# Altium schematic sheet GPS_NEO.SchDoc
size B
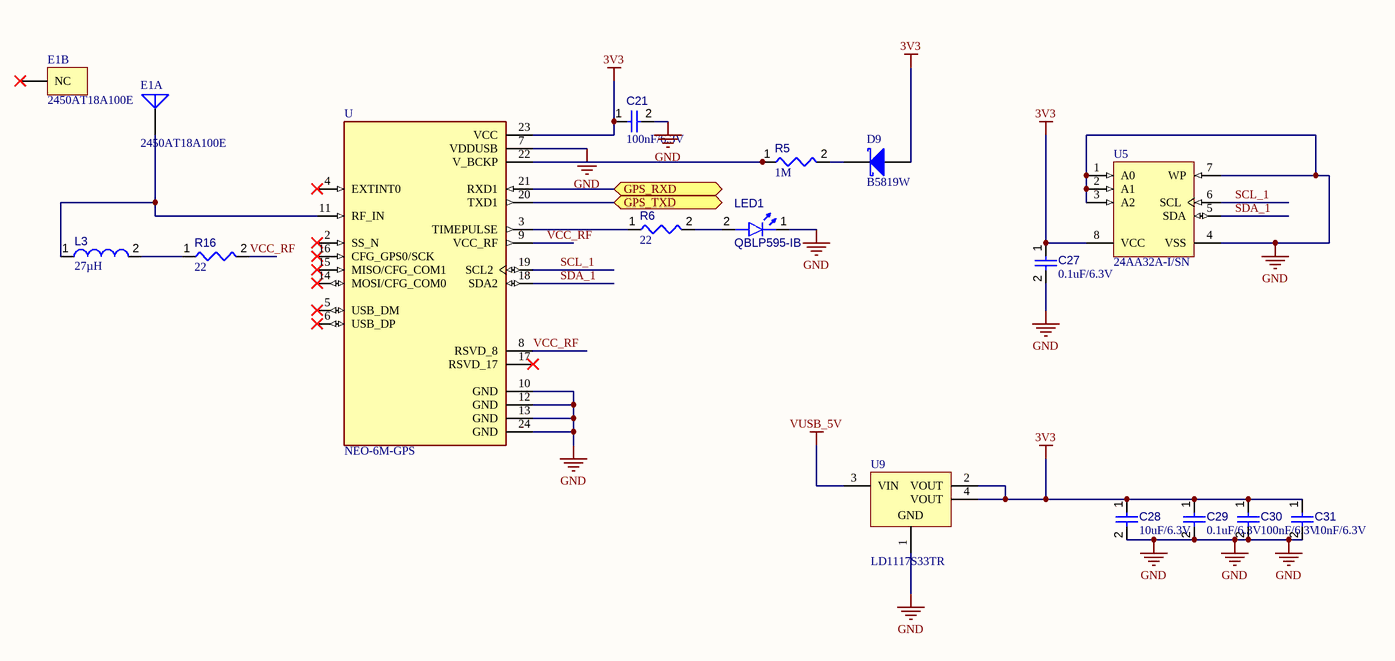
[diagram p0: GPS_NEO.SchDoc]

## Parts
C21  value 100nF/6.3V  [CAPC0402(1005)60_L]  (hidden comment: Capacitor 220nF +/-20% 10V 0402)
C27  value 0.1uF/6.3V  [CAPC0402(1005)60_L]  (hidden comment: Capacitor 220nF +/-20% 10V 0402)
C28  value 10uF/6.3V  [CAPC0402(1005)60_L]  (hidden comment: Capacitor 220nF +/-20% 10V 0402)
C29  value 0.1uF/6.3V  [CAPC0402(1005)60_L]  (hidden comment: Capacitor 220nF +/-20% 10V 0402)
C30  value 100nF/6.3V  [CAPC0402(1005)60_L]  (hidden comment: Capacitor 220nF +/-20% 10V 0402)
C31  value 10nF/6.3V  [CAPC0402(1005)60_L]  (hidden comment: Capacitor 220nF +/-20% 10V 0402)
D9  B5819W  [MCC-SOD123_V]
E1  2450AT18A100E  [JT-2450AT18A100-2_V]  (parts A,B of 2)
L3  value 27µH  [IND1005X55X20VL5T10]  (hidden comment: ELJ-RF2N2DFB)
LED1  QBLP595-IB  [QTB-QBLP595_V]
R5  value 1M  [RESC0402(1005)_L]  (hidden comment: Resistor 1M +/-5 % 0402 63 mW)
R6  value 22  [RESC0402(1005)_L]  (hidden comment: Resistor 22R  +/-5 % 0402 63 mW)
R16  value 22  [RESC0402(1005)_L]  (hidden comment: Resistor 22R  +/-5 % 0402 63 mW)
U  NEO-6M-GPS  [XCVR_NEO-6M-GPS]
U5  24AA32A-I/SN  [SOIC-SN8_N]
U9  LD1117S33TR  [STM-SOT-223_M]

## Ports
GPS_RXD (bidir), GPS_TXD (bidir)

## Nets
3V3: C21.1 C27.1 C28.1 C29.1 C30.1 C31.1 D9.1(A) U.23(VCC) U5.8(VCC) U9.2(VOUT) U9.4(VOUT)
GND: C21.2 C27.2 C28.2 C29.2 C30.2 C31.2 LED1.1(K) U.7(VDDUSB) U.10(GND) U.12(GND) U.13(GND) U.24(GND) U5.1(A0) U5.2(A1) U5.3(A2) U5.4(VSS) U5.7(WP) U9.1(GND)
VUSB_5V: U9.3(VIN)
GPS_RXD: U.21(RXD1) ; port GPS_RXD
GPS_TXD: U.20(TXD1) ; port GPS_TXD
SCL_1: U.19(SCL2) U5.6(SCL)
SDA_1: U.18(SDA2) U5.5(SDA)
VCC_RF: R16.2 U.8(RSVD_8) U.9(VCC_RF)
NetD9_2: D9.2(K) R5.2
NetE1_1: E1.1(FP) L3.1 U.11(RF_IN)
NetL3_2: L3.2 R16.1
NetLED1_2: LED1.2(A) R6.2
NetR5_1: R5.1 U.22(V_BCKP)
NetR6_1: R6.1 U.3(TIMEPULSE)

Not connected (* = marked no-connect by the designer): E1 2(NC)*; U 2(SS_N)* 4(EXTINT0)* 5(USB_DM)* 6(USB_DP)* 14(MOSI/CFG_COM0)* 15(MISO/CFG_COM1)* 16(CFG_GPS0/SCK)* 17(RSVD_17)*

## Library data of the parts
C21 C27-C31 = CMP-001-00057-2: Chip Capacitor, 220nF +/-20%, 10V, 0402, Thickness 0.6 mm; Tolerance: 10%; Case/Package: 0402; Mounting Technology: SMT; Pins: 2; Max Operating Temperature: 85°C; Min Operating Temperature: -55°C; Voltage Rating: 10V
D9 = CMP-004-00005-1: Schottky Barrier Rectifier, 40 V, 1 A, -65 to 125 degC, 2-Pin SOD123, RoHS, Tape and Reel; Manufacturer: Micro Commercial Components; Manufacturer URL: http://www.mccsemi.com/; Package Reference: SOD123; Package URL: http://www.mccsemi.com/up_pdf/1N4448W(SOD-123).pdf; Mounting Technology: SM; Datasheet URL: http://www.mccsemi.com/up_pdf/B5817W-B5819W(SOD-123).pdf; Package Description: 2-Pin Small Outline Diode, Body 2.7 x 1.6 mm, Height 1.35 mm; Case/Package: SOD123; Datasheet Version: Rev. B, 01/2013; RoHS Compliant: Unknown
E1 = CMP-2000-05167-1: Ceramic Antenna, 2.45 GHZ, 2 W, -40 to 125 degC, 2-Pin SMD, RoHS, Tape and Reel; Manufacturer: Johanson Technology; Maximum Frequency: 2500MHz; Typical Antenna Gain: 0.5dB; Minimum Frequency: 2400MHz; Manufacturer URL: https://www.johansontechnology.com/; Type: Ceramic; Datasheet Version: Rev. 1.3, 07/2014; Category: Antenna; Package: 2Case18-4; Datasheet URL: http://www.johansontechnology.com/datasheets/antennas/2450AT18A100.pdf
L3 = CMP-006-00006-4: Chip Inductor, 2.2 nH, +/- 0.3 nH, 400 mA, -40 to 85 degC, 0402 (1005 Metric), RoHS, Tape and Reel; Manufacturer: Panasonic; Current Rating: 400mA; Tolerance: 5%; Shielding: Unshielded; Core Material: Ceramic; Q Factor: 8; Package Reference: 0402; Package Description: 2-Pin Surface Mount Device, Body 1 x 0.5 mm; Packaging: TapeandReel; Max Operating Temperature: 85°C; Case/Package: 0402; Min Operating Temperature: -20°C; Mounting Technology: SM; Package Quantity: 10000; Datasheet Version: Sep-12; RoHS Compliant: True; Datasheet URL: http://www.bourns.com/docs/Product-Datasheets/cm322522.pdf
LED1 = CMP-007-00042-2: Chip LED 0402, Blue, 0.02 A, 3.1 to 3.7 V, -40 to 80 degC, 2-Pin SMD, RoHS, Tape and Reel; Mounting Technology: SMT; Colour: Blue; RoHS Compliant: Yes; Pins: 2; Case/Package: 0402
R5 = CMP-009-00151-2: Chip Resistor, 1 MOhms, +/-5 %, 63 mW, -55 to 155 degC, 0402; Power: 63mW; Tolerance: 5%; Min Operating Temperature: -55°C; Max Operating Temperature: 155°C; Pins: 2; Case/Package: 0402
R6 R16 = CMP-009-00164-2: Chip Resistor, 22 Ohms, +/-5 %, 63 mW, -55 to 155 degC, 0402; Tolerance: 5%; Power: 63mW; Max Operating Temperature: 155°C; Case/Package: 0402; Pins: 2; Min Operating Temperature: -55°C
U = NEO-6M-GPS: SMD GPS Module;; MF: u-blox; Availability: Unavailable; MP: NEO-6M-GPS; Package: None; SnapEDA_Link: https://www.snapeda.com/parts/NEO-6M-GPS/u-blox/view-part/105879/?ref=snap; Value: *; Price: None
U5 = CMP-0159-00205-1: 32Kbit, 400kHz, 1.7V, I2C Serial EEPROM, 8-Pin SOIC 150mil, Industrial Temperature; Code_JEDEC: MS-012; PackageVersion: revBB, Aug-2009; PackageReference: SOIC-SN8; PackageDescription: 8-Lead Plastic Small Outline (SN) - Narrow, 3.90mm Body [SOIC]; Code_IPC: SOIC127P600-8; DatasheetVersion: revJ, Feb-2009
U9 = CMP-019-00019-2: Low Drop Positive Voltage Regulator, 800 mA, Fixed 3.3 V Output, 0 to 125 degC, 3-Pin TO-220, RoHS, Tape and Reel; Manufacturer: STMicroelectronics; Outputs: 1; Min Input Voltage: 4.75V; Max Supply Voltage: 15V; Power: 12W; Dropout Voltage: 1.1V; Max Ouput Current: 1.3A; Output Voltage: 3.3V; Output Current: 950mA; Mounting Technology: SM; Datasheet Version: Rev. 33, 11/2013; Datasheet URL: http://www.farnell.com/datasheets/1776449.pdf; Max Operating Temperature: 125°C; Min Operating Temperature: 0°C; RoHS Compliant: True; Case/Package: TO-261-4; Max Input Voltage: 15V; Manufacturer URL: http://www.st.com/; Min Supply Voltage: 4.75V; Package Quantity: 2500; Nominal Output Voltage: 3.3V; Package Description: 4-Pin Small Outline Transistor, Body 6.5 x 3.5 mm, Pitch 2.3 mm; Pins: 3; Packaging: TapeandReel; Package Reference: SOT-223